# Altium schematic sheet InverterSchematic.SchDoc
size A3; SheetNumber: 1; SheetTotal: 1
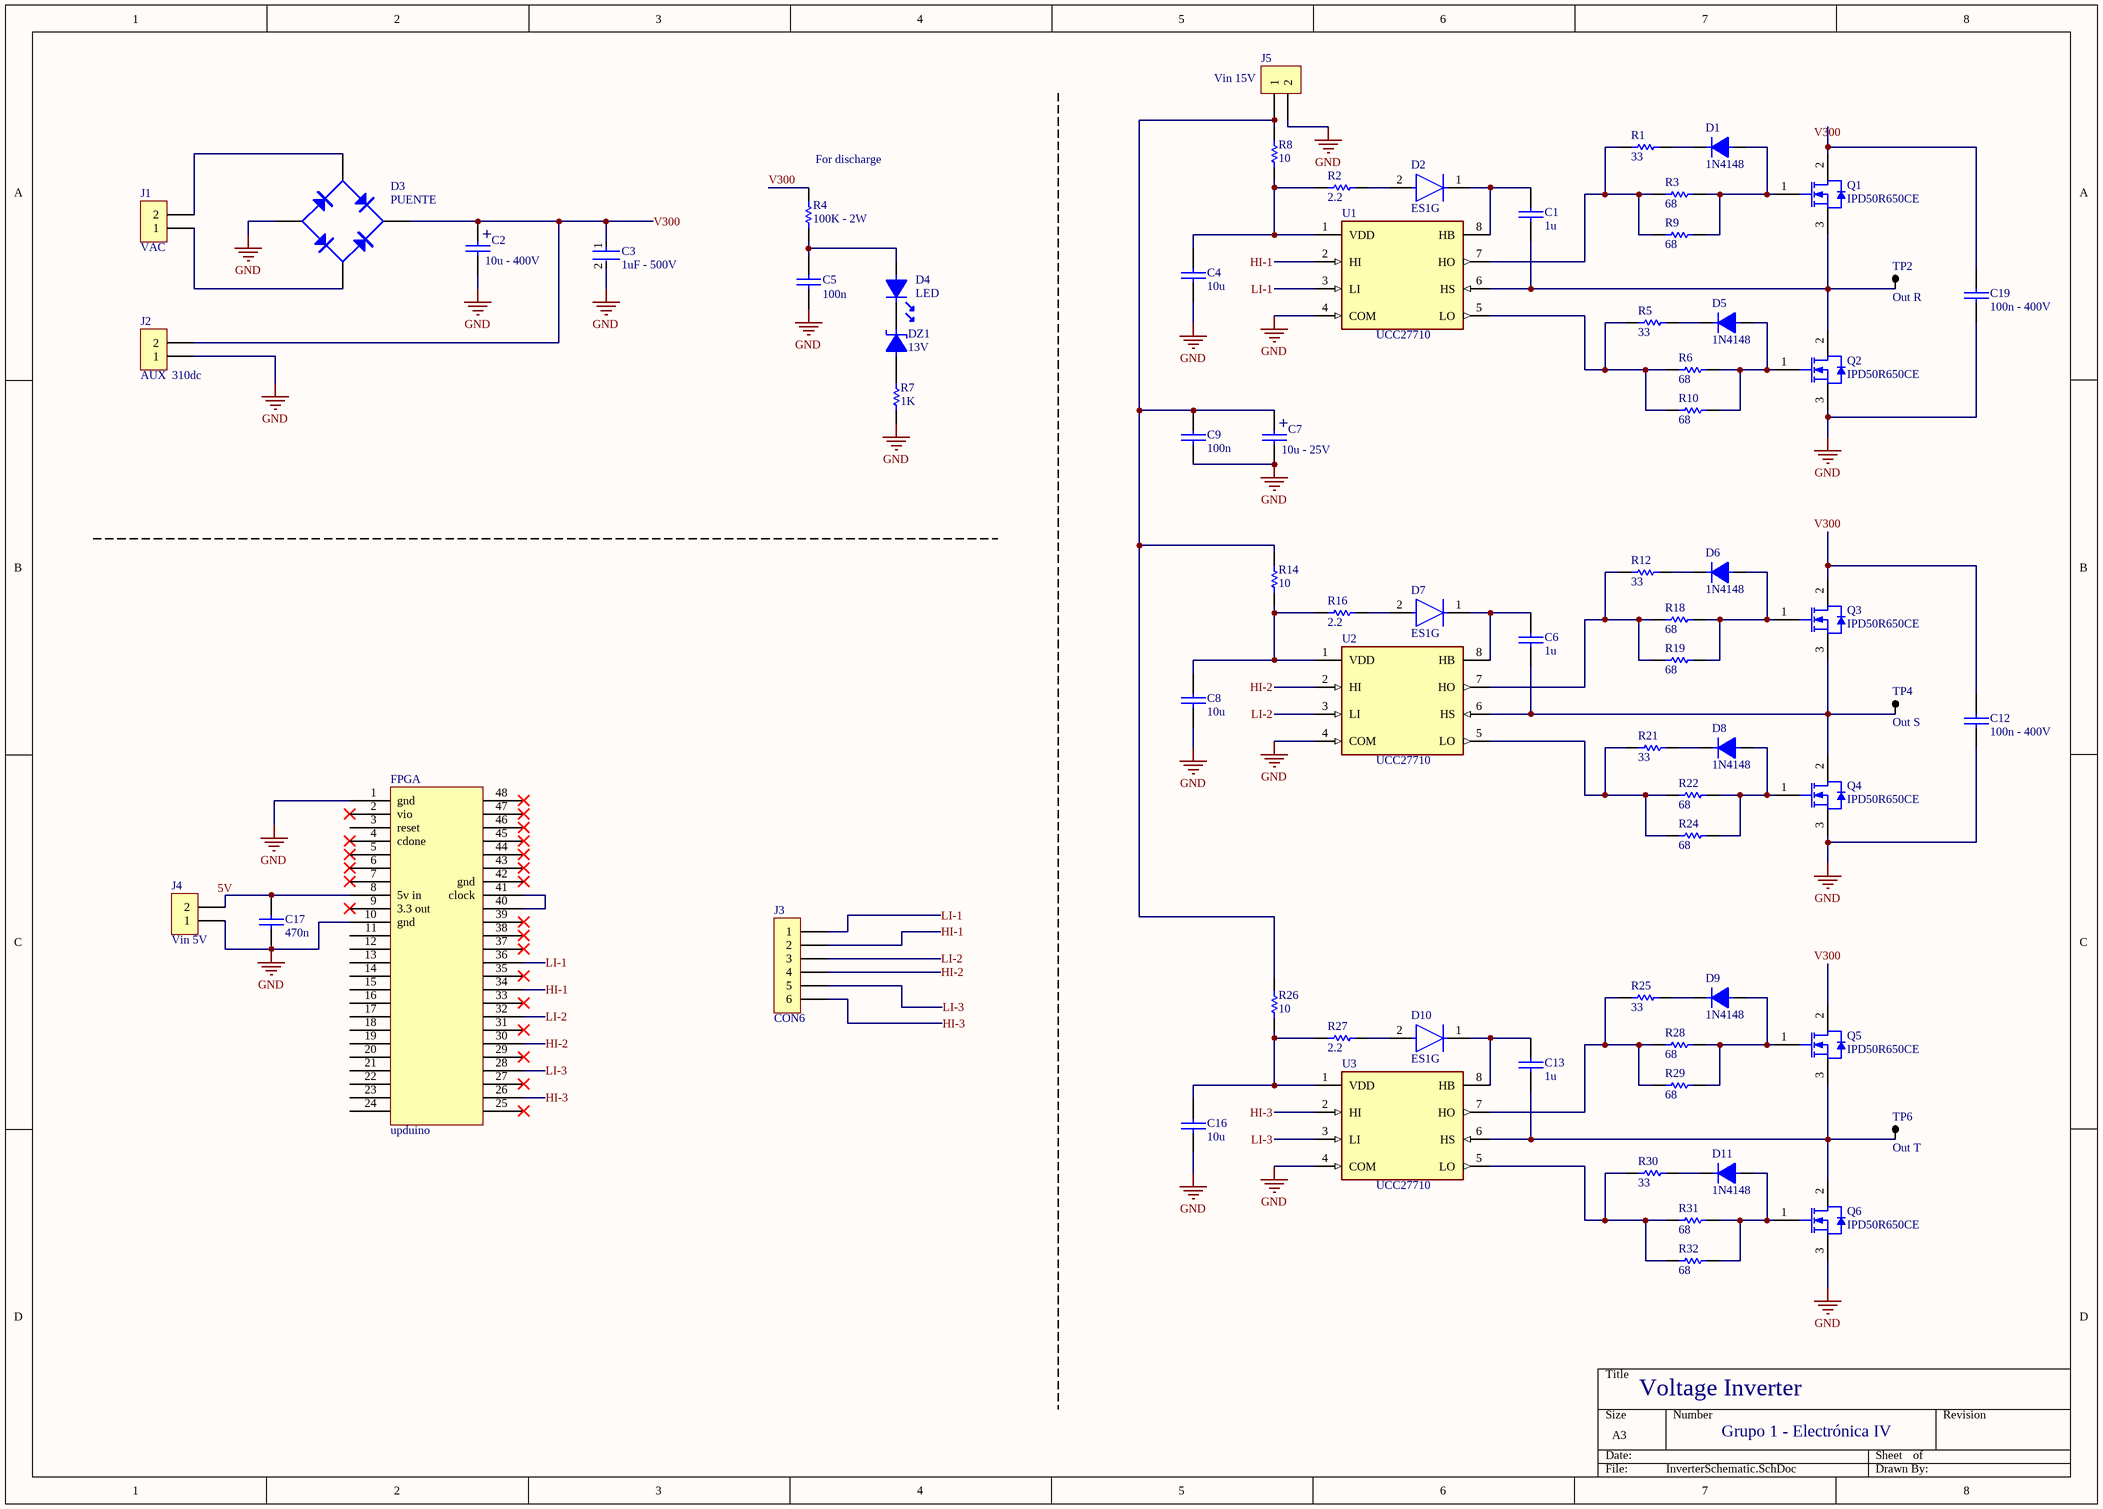
[diagram p0: InverterSchematic.SchDoc]

## Parts
C1  1u  [0805]
C2  10u - 400V  [CAP200RP2]
C3  1uF - 500V  [FP-GRM55D-0_4-IPC_B]
C4  10u  [0805]
C5  100n  [0805]
C6  1u  [0805]
C7  10u - 25V  [CAP100RP]
C8  10u  [0805]
C9  100n  [CAP200]
C12  100n - 400V  [CAP200]
C13  1u  [0805]
C16  10u  [0805]
C17  470n  [0805]
C19  100n - 400V  [CAP200]
D1  1N4148  [DO41]
D2  ES1G  [FP-403AE-MFG]
D3  PUENTE  [PUENTE - W10M]
D4  LED  [LED3]
D5  1N4148  [DO41]
D6  1N4148  [DO41]
D7  ES1G  [FP-403AE-MFG]
D8  1N4148  [DO41]
D9  1N4148  [DO41]
D10  ES1G  [FP-403AE-MFG]
D11  1N4148  [DO41]
DZ1  13V  [DO41]
FPGA  upduino  [FPGA]
J1  VAC  [BORNERA2]
J2  AUX  310dc  [BORNERA2]
J3  CON6  [SIP6]
J4  Vin 5V  [SIP2]
J5  Vin 15V  [SIP2]
Q1  IPD50R650CE  [INF-PG-TO252-3-313_N]
Q2  IPD50R650CE  [INF-PG-TO252-3-313_N]
Q3  IPD50R650CE  [INF-PG-TO252-3-313_N]
Q4  IPD50R650CE  [INF-PG-TO252-3-313_N]
Q5  IPD50R650CE  [INF-PG-TO252-3-313_N]
Q6  IPD50R650CE  [INF-PG-TO252-3-313_N]
R1  33  [0805]
R2  2.2  [RES300]
R3  68  [0805]
R4  100K - 2W  [RES300]
R5  33  [0805]
R6  68  [0805]
R7  1K  [0805]
R8  10  [RES300]
R9  68  [0805]
R10  68  [0805]
R12  33  [0805]
R14  10  [RES300]
R16  2.2  [RES300]
R18  68  [0805]
R19  68  [0805]
R21  33  [0805]
R22  68  [0805]
R24  68  [0805]
R25  33  [0805]
R26  10  [RES300]
R27  2.2  [RES300]
R28  68  [0805]
R29  68  [0805]
R30  33  [0805]
R31  68  [0805]
R32  68  [0805]
TP2  Out R  [TPTH]
TP4  Out S  [TPTH]
TP6  Out T  [TPTH]
U1  UCC27710  [FP-PG-DSO-8-IPC_C]
U2  UCC27710  [FP-PG-DSO-8-IPC_C]
U3  UCC27710  [FP-PG-DSO-8-IPC_C]

## Nets
GND: C2.2 C3.2 C4.2 C5.1 C7.2 C8.2 C9.2 C12.2 C16.2 C17.2 C19.2 D3.3(V-) FPGA.1(gnd) FPGA.10(gnd) J2.1 J4.1 J5.2 Q2.3(SOURCE) Q4.3(SOURCE) Q6.3(SOURCE) R7.2 U1.4(COM) U2.4(COM) U3.4(COM)
5V: C17.1 FPGA.8(5v_in) J4.2
HI-1: FPGA.34 J3.2 U1.2(HI)
HI-2: FPGA.30 J3.4 U2.2(HI)
HI-3: FPGA.26 J3.6 U3.2(HI)
LI-1: FPGA.36 J3.1 U1.3(LI)
LI-2: FPGA.32 J3.3 U2.3(LI)
LI-3: FPGA.28 J3.5 U3.3(LI)
V300: C2.1 C3.1 C12.1 C19.1 D3.1(V+) J2.2 Q1.2(DRAIN) Q3.2(DRAIN) Q5.2(DRAIN) R4.2
NetC1_1: C1.1 D2.1(C) U1.8(HB)
NetC1_2: C1.2 Q1.3(SOURCE) Q2.2(DRAIN) TP2.1 U1.6(HS)
NetC4_1: C4.1 R2.1 R8.1 U1.1(VDD)
NetC5_2: C5.2 D4.1 R4.1
NetC6_1: C6.1 D7.1(C) U2.8(HB)
NetC6_2: C6.2 Q3.3(SOURCE) Q4.2(DRAIN) TP4.1 U2.6(HS)
NetC7_1: C7.1 C9.1 J5.1 R8.2 R14.2 R26.2
NetC8_1: C8.1 R14.1 R16.1 U2.1(VDD)
NetC13_1: C13.1 D10.1(C) U3.8(HB)
NetC13_2: C13.2 Q5.3(SOURCE) Q6.2(DRAIN) TP6.1 U3.6(HS)
NetC16_1: C16.1 R26.1 R27.1 U3.1(VDD)
NetD1_1: D1.1 Q1.1(GATE) R3.2 R9.2
NetD1_2: D1.2 R1.2
NetD2_2: D2.2(A) R2.2
NetD3_2: D3.2(AC) J1.2
NetD3_4: D3.4(AC) J1.1
NetD4_2: D4.2 DZ1.2
NetD5_1: D5.1 Q2.1(GATE) R6.2 R10.2
NetD5_2: D5.2 R5.2
NetD6_1: D6.1 Q3.1(GATE) R18.2 R19.2
NetD6_2: D6.2 R12.2
NetD7_2: D7.2(A) R16.2
NetD8_1: D8.1 Q4.1(GATE) R22.2 R24.2
NetD8_2: D8.2 R21.2
NetD9_1: D9.1 Q5.1(GATE) R28.2 R29.2
NetD9_2: D9.2 R25.2
NetD10_2: D10.2(A) R27.2
NetD11_1: D11.1 Q6.1(GATE) R31.2 R32.2
NetD11_2: D11.2 R30.2
NetDZ1_1: DZ1.1 R7.1
NetFPGA_40: FPGA.40 FPGA.41(clock)
NetR1_1: R1.1 R3.1 R9.1 U1.7(HO)
NetR5_1: R5.1 R6.1 R10.1 U1.5(LO)
NetR12_1: R12.1 R18.1 R19.1 U2.7(HO)
NetR21_1: R21.1 R22.1 R24.1 U2.5(LO)
NetR25_1: R25.1 R28.1 R29.1 U3.7(HO)
NetR30_1: R30.1 R31.1 R32.1 U3.5(LO)

Not connected (* = marked no-connect by the designer): FPGA 2(vio)* 3(reset) 4(cdone)* 5* 6* 7* 9(3.3_out)* 11 12 13 14 15 16 17 18 19 20 21 22 23 24 25* 27* 29* 31* 33* 35* 37* 38* 39* 42(gnd)* 43* 44* 45* 46* 47* 48*

## Notes on the sheet
- (near R4) For discharge
- Voltage Inverter
- Grupo 1 - Electrónica IV
- (in symbol CAPPOL) +

## Library data of the parts
C1 C4-C6 C8 C9 C12 C13 C16 C17 C19 = CAP
C2 C7 = CAPPOL
C3 = CMP-2000-06370-2: Chip Multilayer Ceramic Capacitors for General Purpose, 2220, 1.0uF, X7R, 15%, 10%, 500V; Voltage Rating (DC): 250V; Width: 5mm; Capacitance: 1uF; Height: 2mm; Case Code (Imperial): 2220; Max Operating Temperature: 125°C; Number of Pins: 2; Min Operating Temperature: -55°C; Termination: SMD/SMT; Case/Package: 2220; Dielectric: X7R; Material: Ceramic; REACH SVHC: No SVHC; Voltage: 250V; Packaging: Tape and Reel; Thickness: 0.087inch; Depth: 5mm; Package Quantity: 1; Tolerance: 10%; Mount: Surface Mount; Voltage Rating: 250V; Length: 5.7mm; Case Code (Metric): 5750; Lead Free: Lead Free
D1 D5 D6 D8 D9 D11 = DIODO
D2 D7 D10 = CMP-07163-000025-1: DIODE GEN PURP 400V 1A SMA; Manufacturer: ON Semiconductor; Capacitance: 10pF; Peak Reverse Current: 5uA; Standoff Height: 0.05mm; Value: 10pF; Max Junction Temp: +150°C; Max Surge Forward Current: 30A; Mouser Description: Rectifiers 1.0 A Ultra Fast Recovery Rect; Digikey Description: DIODE GEN PURP 400V 1A SMA; Device Class L1: Discrete Semiconductors; Automotive: No; Octopart: https://octopart.com/es1g-on+semiconductor-84324858; Height: 2.5mm; Temperature: to +150°C; RoHS: TRUE; Footprint Url: https://www.onsemi.com/pub/Collateral/403AE.PDF; Temperature Range High: +150°C; Category: Diode; Lead Free: Yes; Max Repetitive Reverse Voltage: 400V; Package: 403AE; ComponentLink2Description: Datasheet; Forward Current: 1A; ComponentLink2URL: https://www.onsemi.com/pub/Collateral/ES1J-D.PDF; Device Class L3: Rectifier Diodes; Device Class L2: Diodes; Manufacturer Part Number: ES1G
DZ1 = DIODO ZENER
FPGA = FPGA: upduino v3.0
J1 J2 = BORNERA 2
J4 J5 = CON2: UPDuino Power Input
Q1-Q6 = CMP-1164-00335-1: N-Channel CoolMOS CE Power-Transistor, 500 V VDS, 6.1 A ID, -55 to 150 degC, PG-TO252-3-313, Reel, Green; Manufacturer: Infineon; VDS (max): 500Â V; IDpuls (max): 19Â A; Rth: 2.67Â K/W; RDS (on) (max): 650Â mOhm; ID (max): 6.1Â A; Polarity: N; QG: 15Â nC; Green: TRUE; Ptot (max): 47Â W; VGS(th) (max): 3.5Â V; RthJA (max): 62Â K/W; VGS(th) (min): 2.5Â V; ComponentLink2URL: http://www.infineon.com/dgdl/IPD50R650CE+2.0.pdf?folderId=db3a3043156fd5730115c736bcc70ff2&fileId=db3a304339d29c450139d41341a202a1; ComponentLink1Description: Manufacturer URL; PartNumber: IPD50R650CE; ComponentLink3Description: Package Specification; ComponentLink2Description: Datasheet; PackageReference: PG-TO252-3-313; PackageDescription: 3-Pin Plastic (Green) Transistor Single Outline Package, 6.5 x 6.12 mm Body, 2.28 mm Pitch; PackageVersion: Oct-10; ComponentLink3URL: http://www.infineon.com/dgdl/PG-TO252-3-313-Package_Overview.pdf?folderId=db3a30432b57a660012b81890ade72d2&fileId=db3a30432b57a660012b8193af2872eb; Packing: Reel; Mounting Technology: Surface Mount; ComponentLink1URL: http://www.infineon.com/; Technology: CoolMOS CE; DatasheetVersion: Rev. 2.0; RthJC (max): 2.67Â K/W
R1 R12 R25 = RES: 33?
R2-R10 R14 R16 R18 R19 R21 R22 R24 R26-R32 = RES
TP2 TP4 TP6 = TP
U1-U3 = CMP-32851-000209-1: GATE DRVR HI/LOW SIDE 8SOIC; Number of Drivers: 2; Channel Type: Independent; Max Supply Voltage: 20V; Output Voltage: 620V; Propagation Delay: 160ns; Min Supply Voltage: 10V; Max Output Current: 600mA; Fall Time: 90ns; Number of Outputs: 2; Lead Free: Lead Free; Reach SVHC Compliant: Yes; Min Operating Temperature: -40°C; Packaging: Rail/Tube; Series: -; Number of Pins: 8; RoHS Compliant: Yes; Width: 0.157inch; Mount: Surface Mount; Case/Package: SOIC; Number of Channels: 2; Max Operating Temperature: 150°C; Package Quantity: 95; Halogen Free: Halogen Free; Length: 0.196inch; Output Current: 600mA; Height: 0.059inch